# Altium project TGIS System Status.PrjPcb (part 1 of 2)
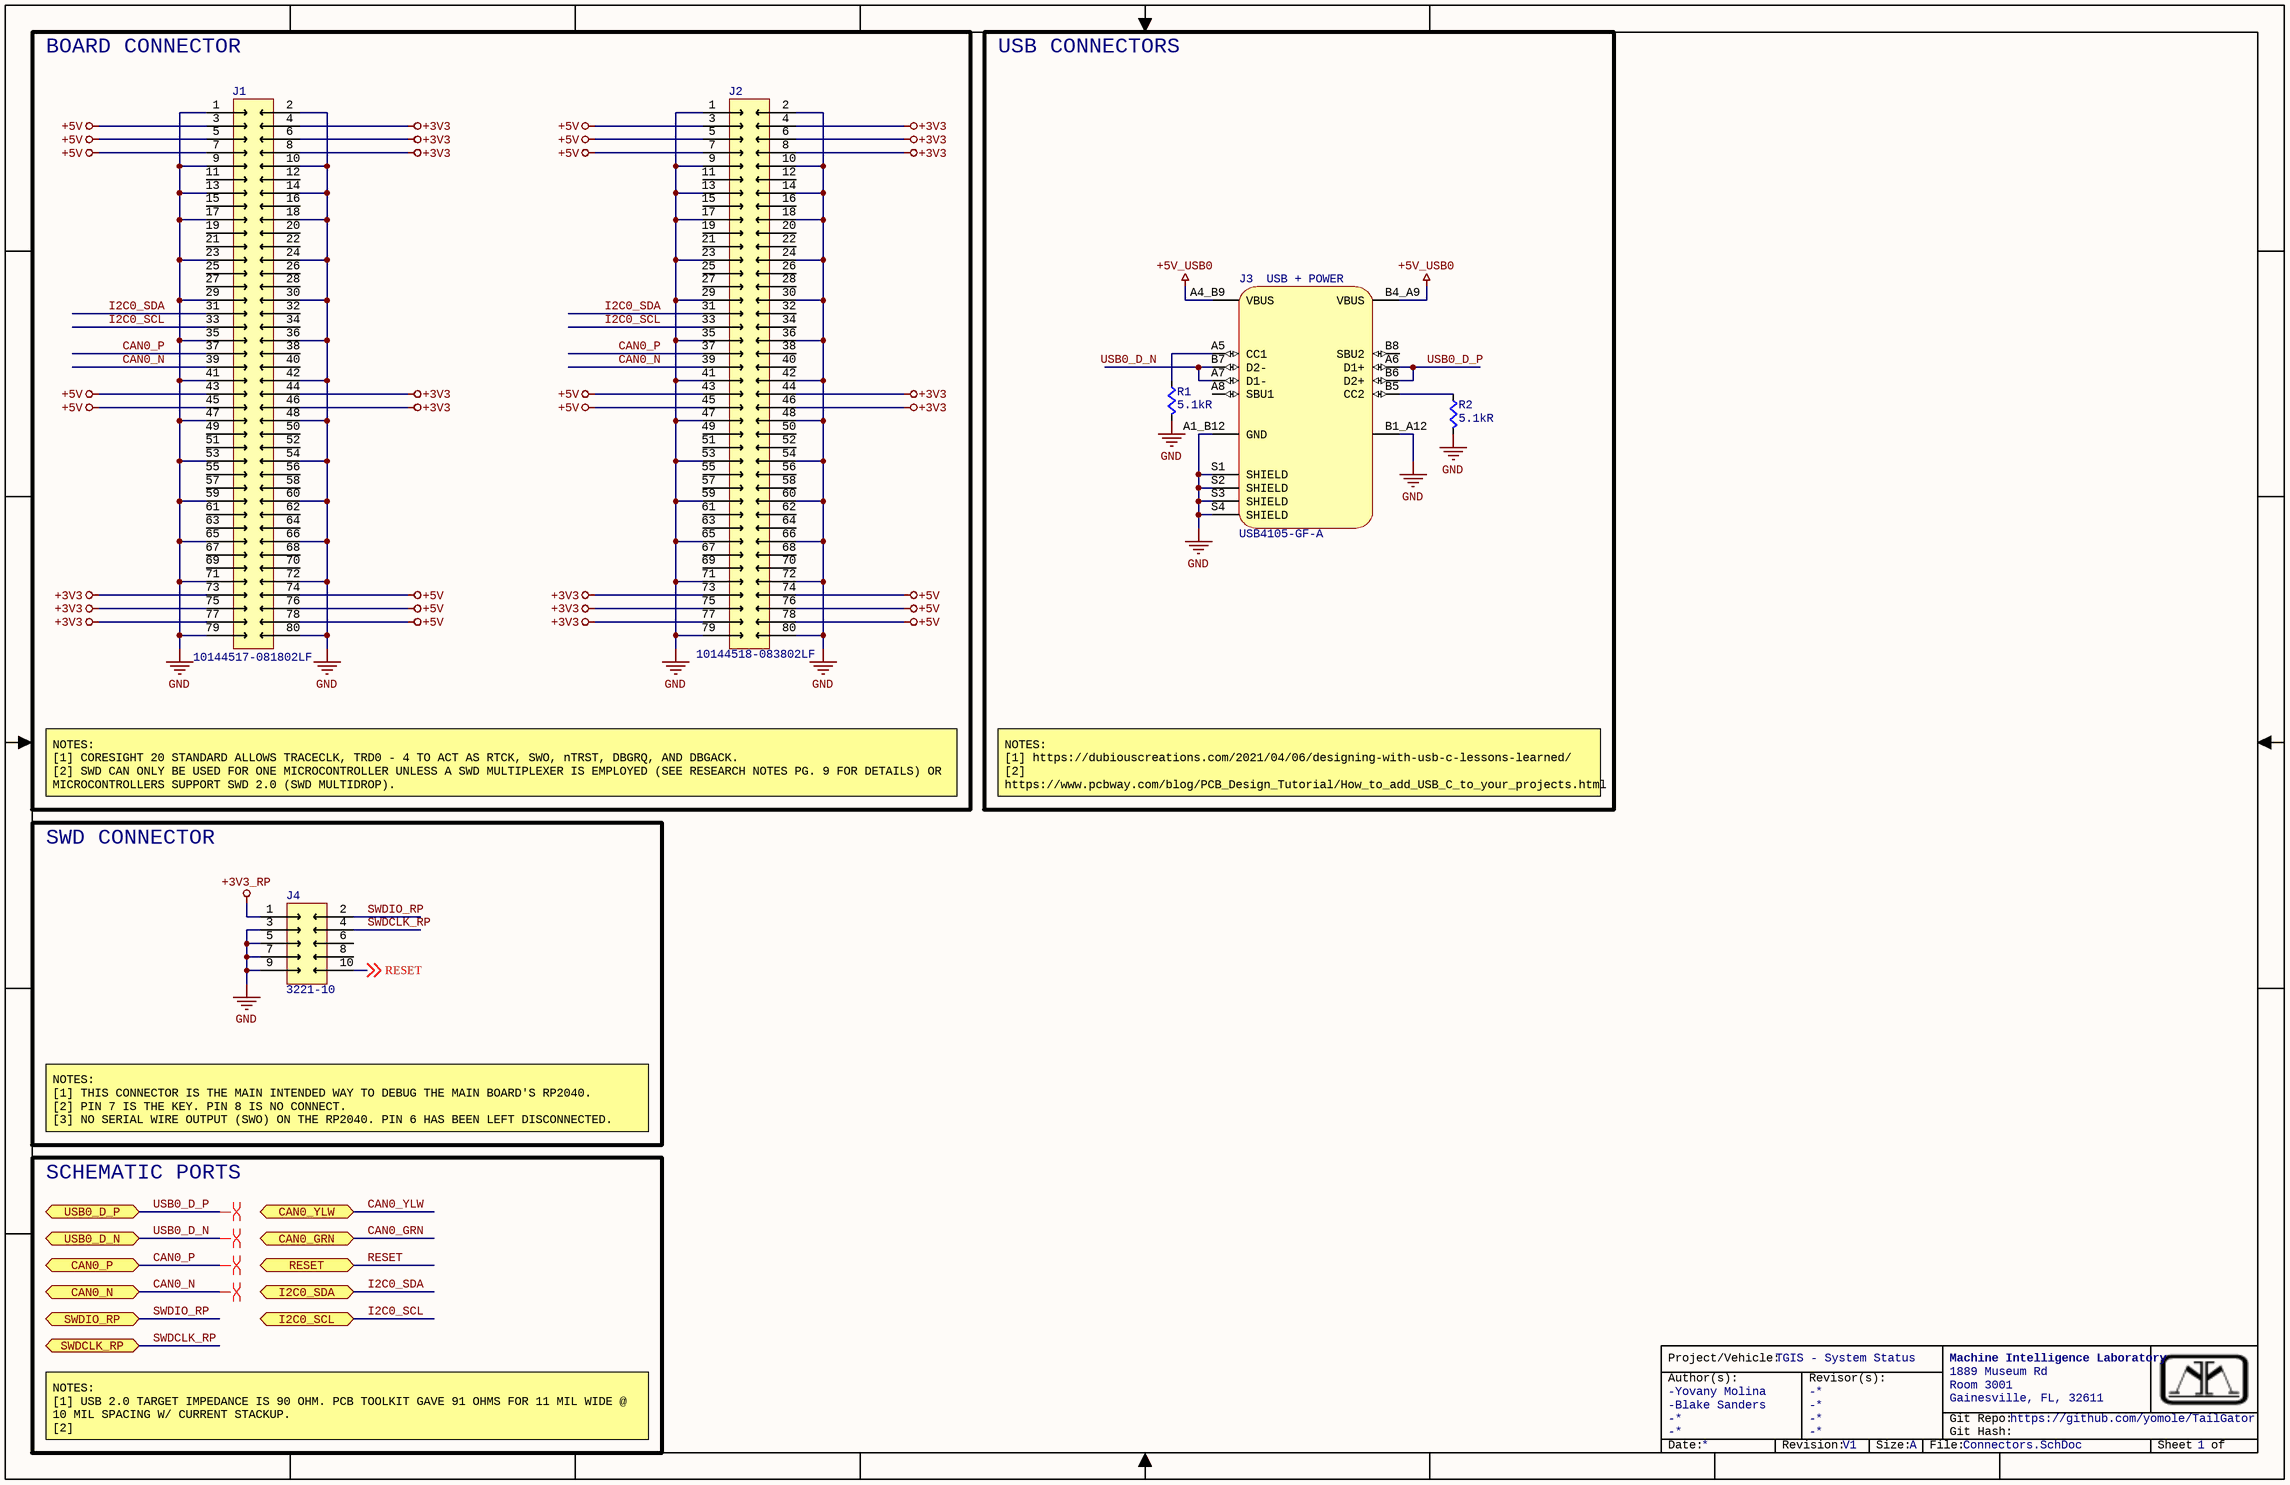
[diagram p0: Connectors.SchDoc]
Author1: Yovany Molina; Author2: Blake Sanders; Project: TGIS - System Status; Revision: V1; VersionControl_Repository: https://github.com/yomole/TailGator
4 sheets, 74 parts. Net scope: flat (ports and power ports of the same name join across sheets).
Board file: SystemStatus.PcbDoc
Sheets:
  Connectors.SchDoc
  Microcontroller.SchDoc
  Power.SchDoc
  Components.SchDoc

## Sheet Connectors.SchDoc
size 431 x 279 mm; Organization: Machine Intelligence Laboratory; Address1: 1889 Museum Rd; Address2: Room 3001; Address3: Gainesville, FL, 32611; SheetNumber: 1; SheetTotal: 4

### Parts
J1  10144517-081802LF  [AMPHENOL_10144517-081802LF]
J2  10144518-083802LF  [AMPHENOL_10144518-083802LF]
J3  USB4105-GF-A  [GCT_USB4105-GF-A]
J4  3221-10  [3220-10-0200-00]
R1  5.1kR  [RES0603]
R2  5.1kR  [RES0603]

### Blocks framed on the sheet
BOARD CONNECTOR: J1 J2
USB CONNECTORS: J3 R1 R2
SWD CONNECTOR: J4

### Ports
CAN0_GRN (bidir, see Components[3C], Microcontroller[2D]), CAN0_N (bidir, see Components[3C]), CAN0_P (bidir, see Components[3C]), CAN0_YLW (bidir, see Components[3C], Microcontroller[2C]), I2C0_SCL (bidir, see Microcontroller[2D]), I2C0_SDA (bidir, see Microcontroller[2D]), RESET (bidir), SWDCLK_RP (bidir, see Microcontroller[3C]), SWDIO_RP (bidir, see Microcontroller[3C]), USB0_D_N (bidir, see Microcontroller[2C]), USB0_D_P (bidir, see Microcontroller[2C])

### Nets
+3V3: J1.4 J1.6 J1.8 J1.44 J1.46 J1.73 J1.75 J1.77 J2.4 J2.6 J2.8 J2.44 J2.46 J2.73 J2.75 J2.77
+3V3_RP: J4.1
+5V: J1.3 J1.5 J1.7 J1.43 J1.45 J1.74 J1.76 J1.78 J2.3 J2.5 J2.7 J2.43 J2.45 J2.74 J2.76 J2.78
+5V_USB0: J3.A4_B9(VBUS) J3.B4_A9(VBUS)
GND: J1.1 J1.2 J1.9 J1.10 J1.13 J1.14 J1.17 J1.18 J1.23 J1.24 J1.29 J1.30 J1.35 J1.36 J1.41 J1.42 J1.47 J1.48 J1.53 J1.54 J1.59 J1.60 J1.65 J1.66 J1.71 J1.72 J1.79 J1.80 J2.1 J2.2 J2.9 J2.10 J2.13 J2.14 J2.17 J2.18 J2.23 J2.24 J2.29 J2.30 J2.35 J2.36 J2.41 J2.42 J2.47 J2.48 J2.53 J2.54 J2.59 J2.60 J2.65 J2.66 J2.71 J2.72 J2.79 J2.80 J3.A1_B12(GND) J3.B1_A12(\) J3.S1(SHIELD) J3.S2(SHIELD) J3.S3(SHIELD) J3.S4(SHIELD) J4.3 J4.5 J4.7 J4.9 R1.1(A) R2.1(A)
CAN0_N: J1.39 J2.39 ; port CAN0_N
CAN0_P: J1.37 J2.37 ; port CAN0_P
I2C0_SCL: J1.33 J2.33 ; port I2C0_SCL
I2C0_SDA: J1.31 J2.31 ; port I2C0_SDA
RESET: J4.10 ; off-sheet RESET, port RESET
SWDCLK_RP: J4.4 ; port SWDCLK_RP
SWDIO_RP: J4.2 ; port SWDIO_RP
USB0_D_N: J3.A7(D1-) J3.B7(D2-) ; port USB0_D_N
USB0_D_P: J3.A6(D1+) J3.B6(D2+) ; port USB0_D_P
NetJ3_A5: J3.A5(CC1) R1.2(B)
NetJ3_B5: J3.B5(CC2) R2.2(B)

Not connected (* = marked no-connect by the designer): J1 11 12 15 16 19 20 21 22 25 26 27 28 32 34 38 40 49 50 51 52 55 56 57 58 61 62 63 64 67 68 69 70; J2 11 12 15 16 19 20 21 22 25 26 27 28 32 34 38 40 49 50 51 52 55 56 57 58 61 62 63 64 67 68 69 70; J3 A8(SBU1) B8(SBU2); J4 6 8

### Layout directives
differential pair; net class USB0_D; differential pair class USB0_LINES; rule Matched Net Lengths [Tolerance = 10mil]; rule Differential Pairs Routing [Pref Gap = 4mil    Min Gap  = 4mil    Max Gap  = 4milPref Width = 6mil    Min Width  = 6mil    Max Width  = 6mil]: USB0_D_N, USB0_D_P
differential pair; rule Matched Net Lengths [Tolerance = 5mil]; rule Differential Pairs Routing [Pref Gap = 6mil    Min Gap  = 6mil    Max Gap  = 6milPref Width = 4mil    Min Width  = 4mil    Max Width  = 4mil]; net class CAN0; differential pair class CAN0_LINES: CAN0_N, CAN0_P

### Notes on the sheet
- (near J3) USB + POWER
- NOTES:
  [1] CORESIGHT 20 STANDARD ALLOWS TRACECLK, TRD0 - 4 TO ACT AS RTCK, SWO, nTRST, DBGRQ, AND DBGACK.
  [2] SWD CAN ONLY BE USED FOR ONE MICROCONTROLLER UNLESS A SWD MULTIPLEXER IS EMPLOYED (SEE RESEARCH NOTES PG. 9 FOR DETAILS) OR MICROCONTROLLERS SUPPORT SWD 2.0 (SWD MULTIDROP).
- NOTES:
  [1] https://dubiouscreations.com/2021/04/06/designing-with-usb-c-lessons-learned/
  [2] https://www.pcbway.com/blog/PCB_Design_Tutorial/How_to_add_USB_C_to_your_projects.html
  [3] DO NOT FORGET TO SECURE THE MECHANICAL POLES BEFORE CONNECTING ANYTHING.
- NOTES:
  [1] THIS CONNECTOR IS THE MAIN INTENDED WAY TO DEBUG THE MAIN BOARD'S RP2040.
  [2] PIN 7 IS THE KEY. PIN 8 IS NO CONNECT.
  [3] NO SERIAL WIRE OUTPUT (SWO) ON THE RP2040. PIN 6 HAS BEEN LEFT DISCONNECTED.
- SCHEMATIC PORTS
- NOTES:
  [1] USB 2.0 TARGET IMPEDANCE IS 90 OHM. PCB TOOLKIT GAVE 91 OHMS FOR 11 MIL WIDE @ 10 MIL SPACING W/ CURRENT STACKUP.
  [2] http://lamsimenterprises.com/COUPLED%20TRANSMISSION%20LINES%20AND%20Crosstalk.pdf
- Project/Vehicle:
- Author(s):
- -
- Revisor(s):
- Git Repo:
- Git Hash:
- Date:
- Revision:
- Size:
- A
- File:
- Sheet
- of

### Library data of the parts
J1 = 10144517-081802LF: CONN RCPT 1 80POS SMD GOLD; System: Connector; Supplier 1: Digikey; Supplier Part Number 1: 609-5437-1-ND
J2 = 10144518-083802LF: CONN PLUG 3 80POS SMD GOLD; System: Connector; Supplier 1: Digikey; Supplier Part Number 1: 609-5455-1-ND
J3 = USB4105-GF-A: USB-C (USB TYPE-C) USB 2.0 Receptacle Connector 24 (16+8 Dummy) Position Surface Mount, Right Angle; Through Hole; MP: USB4120-03-C_REVA; Package: None; Value: *; Availability: Unavailable; Price: None; Supplier 1: Newark; Supplier Part Number 1: 71AJ9393
J4 = 3221-10-0300-00: Connector Header Surface Mount 10 position 0.050" (1.27mm); Supplier 1: Digikey; Supplier Part Number 1: 1175-1735-ND
R1 R2 = RC0603FR-075K1L: Fixed Resistor, Metal Glaze/thick F; Manufacturer: Yageo; Power: 100mW; Rated Temperature: 70°C; Tolerance: 1%; Additional Feature: LASER TRIMMABLE; Temperature Coefficient: 100ppm/°C; Working Voltage: 75V; Package Height: 0.45mm; Package Length: 1.6mm; Package Width: 0.8mm; Part Number: RC0603FR-075K1L; Category: Chip SMD Resistors; Stock 1: 2654160; Pricing 1: 1=0.1, 10=0.019, 50=0.0112, 100=0.0; Mounting Technology: Surface Mount; Pins: 2; Package Shape: Rectangular; Case/Package: 0603; Terminal Finish: Nickel; Min Operating Temperature: -55°C; Max Operating Temperature: 155°C; JESD-609 Code: e3; Resistor Type: FIXED RESISTOR; Packaging: Tape and Reel; Value: 5.1kR; Termination: Wraparound; Technology: METAL GLAZE/THICK FILM; Reach SVHC Compliant: Yes; RoHS Compliant: Yes; ComponentLink1URL: https://datasheet.ciiva.com:443/pdf; ComponentLink1Description: https://datasheet.ciiva.com:443/pdf; ComponentLink2URL: https://datasheet.ciiva.com/46395/4; ComponentLink2Description: https://datasheet.ciiva.com/46395/4; ComponentLink3URL: https://datasheet.ciiva.com/2454/py; ComponentLink3Description: https://datasheet.ciiva.com/2454/py; ComponentLink4URL: https://datasheet.ciiva.com/2454/py; ComponentLink4Description: https://datasheet.ciiva.com/2454/py; ComponentLink5URL: https://datasheet.ciiva.com/2454/py; ComponentLink5Description: https://datasheet.ciiva.com/2454/py; ComponentLink6URL: https://datasheet.ciiva.com/15189/g; ComponentLink6Description: https://datasheet.ciiva.com/15189/g; Supplier Part Number 1: 311-5.10KHRCT-ND; Manufacturer Part Number: RC0603FR-075K1L; RoHS: Yes; Construction: Chip; Package Style: SMTMeter; Supplier 1: Digikey

## Sheet Microcontroller.SchDoc
size A; Organization: Machine Intelligence Laboratory; Address1: 1889 Museum Rd; Address2: Room 3001; Address3: Gainesville, FL, 32611; SheetNumber: 2; SheetTotal: 4
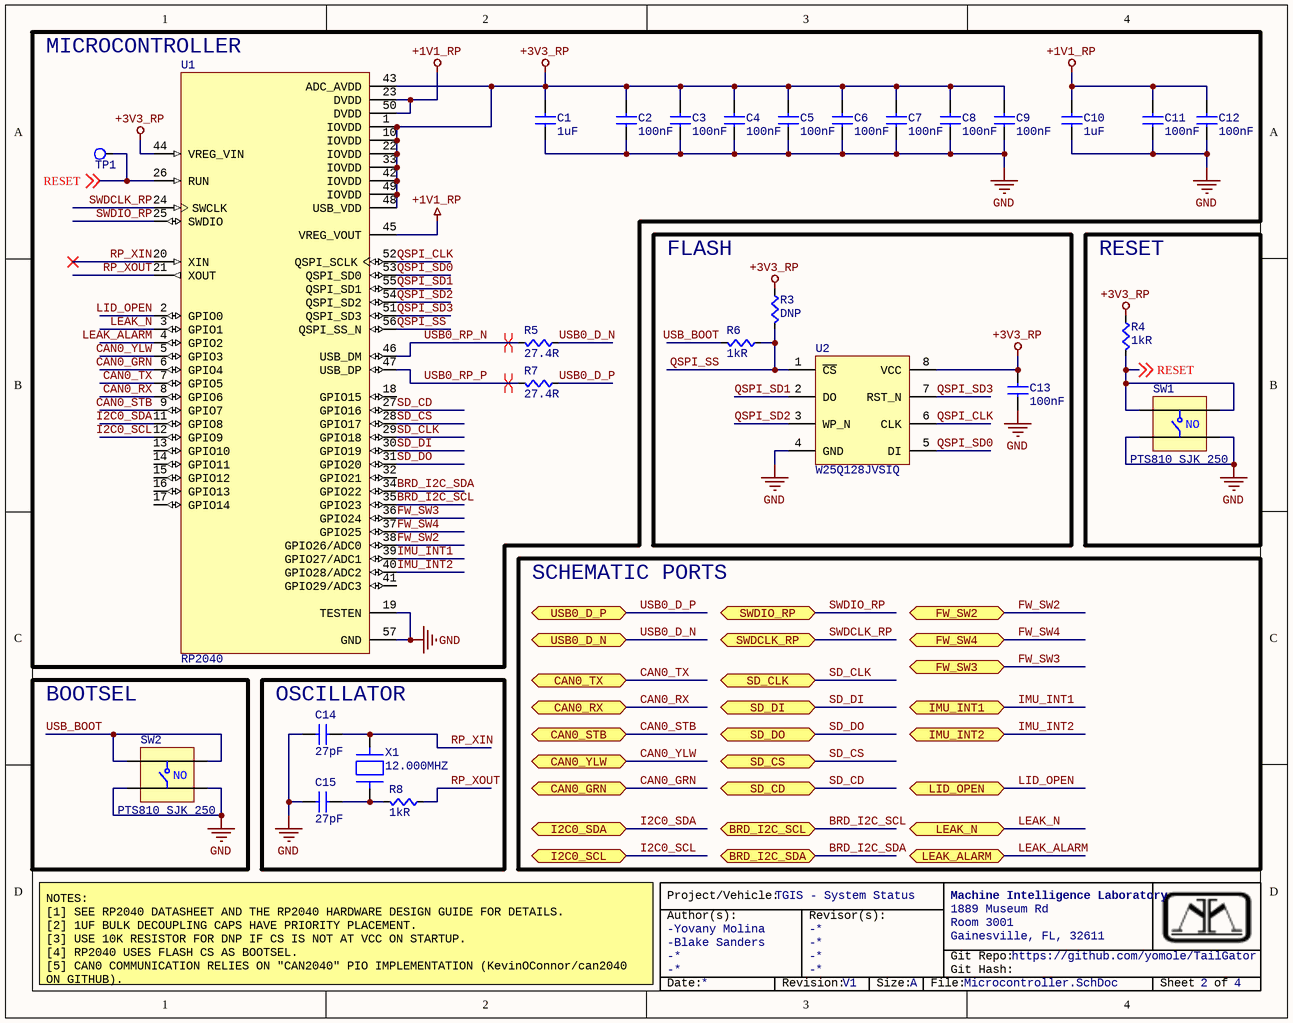
[diagram p1: Microcontroller.SchDoc]

### Parts
C1  1uF  [CAPC0603]
C2  100nF  [CAPC0603]
C3  100nF  [CAPC0603]
C4  100nF  [CAPC0603]
C5  100nF  [CAPC0603]
C6  100nF  [CAPC0603]
C7  100nF  [CAPC0603]
C8  100nF  [CAPC0603]
C9  100nF  [CAPC0603]
C10  1uF  [CAPC0603]
C11  100nF  [CAPC0603]
C12  100nF  [CAPC0603]
C13  100nF  [CAPC0603]
C14  27pF  [CAPC0603]
C15  27pF  [CAPC0603]
R3  value DNP  [RES0603]  (hidden comment: Res)
R4  1kR  [RES0603]
R5  27.4R  [RES0603]
R6  1kR  [RES0603]
R7  27.4R  [RES0603]
R8  1kR  [RES0603]
SW1  PTS810 SJK 250  [SW_PTS810_SJM_250_SMTR_LFS]
SW2  PTS810 SJK 250  [SW_PTS810_SJM_250_SMTR_LFS]
TP1  TP  [TPAD-60MIL]  (value not drawn)  (no BOM)
U1  RP2040  [QFN40P700X700X90-57N]
U2  W25Q128JVSIQ  [SOIC127P790X216-8N]
X1  12.000MHZ  [ABLS-12.000MHZ]

### Blocks framed on the sheet
MICROCONTROLLER: C1-C12 R5 R7 TP1 U1
FLASH: C13 R3 R6 U2
RESET: R4 SW1
BOOTSEL: SW2
OSCILLATOR: C14 C15 R8 X1

### Ports
BRD_I2C_SCL (bidir, see Components[3D]), BRD_I2C_SDA (bidir, see Components[3D]), CAN0_GRN (bidir, see Components[3C], Connectors[8A]), CAN0_RX (bidir, see Components[3C]), CAN0_STB (bidir, see Components[3C]), CAN0_TX (bidir, see Components[3C]), CAN0_YLW (bidir, see Components[3C], Connectors[8B]), FW_SW2 (bidir, see Components[3C]), FW_SW3 (bidir, see Components[3D]), FW_SW4 (bidir, see Components[3D]), I2C0_SCL (bidir, see Connectors[8A]), I2C0_SDA (bidir, see Connectors[8A]), IMU_INT1 (bidir, see Components[3C]), IMU_INT2 (bidir, see Components[3D]), LEAK_ALARM (bidir, see Components[3D]), LEAK_N (bidir, see Components[3D]), LID_OPEN (bidir, see Components[3C]), SD_CD (bidir, see Components[3C]), SD_CLK (bidir, see Components[3C]), SD_CS (bidir, see Components[3C]), SD_DI (bidir, see Components[3C]), SD_DO (bidir, see Components[3C]), SWDCLK_RP (bidir, see Connectors[8A]), SWDIO_RP (bidir, see Connectors[8A]), USB0_D_N (bidir, see Connectors[8A]), USB0_D_P (bidir, see Connectors[8B])

### Nets
+1V1_RP: C10.2(B) C11.2(B) C12.2(B) U1.23(DVDD) U1.45(VREG_VOUT) U1.50(DVDD)
+3V3_RP: C1.2(B) C2.2(B) C3.2(B) C4.2(B) C5.2(B) C6.2(B) C7.2(B) C8.2(B) C9.2(B) C13.2(B) R3.2(B) R4.2(B) U1.1(IOVDD) U1.10(IOVDD) U1.22(IOVDD) U1.33(IOVDD) U1.42(IOVDD) U1.43(ADC_AVDD) U1.44(VREG_VIN) U1.48(USB_VDD) U1.49(IOVDD) U2.8(VCC)
GND: C1.1(A) C2.1(A) C3.1(A) C4.1(A) C5.1(A) C6.1(A) C7.1(A) C8.1(A) C9.1(A) C10.1(A) C11.1(A) C12.1(A) C13.1(A) C14.1(A) C15.1(A) SW1.3 SW1.4 SW2.3 SW2.4 U1.19(TESTEN) U1.57(GND) U2.4(GND)
BRD_I2C_SCL: U1.35(GPIO23) ; port BRD_I2C_SCL
BRD_I2C_SDA: U1.34(GPIO22) ; port BRD_I2C_SDA
CAN0_GRN: U1.6(GPIO4) ; port CAN0_GRN
CAN0_RX: U1.8(GPIO6) ; port CAN0_RX
CAN0_STB: U1.9(GPIO7) ; port CAN0_STB
CAN0_TX: U1.7(GPIO5) ; port CAN0_TX
CAN0_YLW: U1.5(GPIO3) ; port CAN0_YLW
FW_SW2: U1.38(GPIO26/ADC0) ; port FW_SW2
FW_SW3: U1.36(GPIO24) ; port FW_SW3
FW_SW4: U1.37(GPIO25) ; port FW_SW4
I2C0_SCL: U1.12(GPIO9) ; port I2C0_SCL
I2C0_SDA: U1.11(GPIO8) ; port I2C0_SDA
IMU_INT1: U1.39(GPIO27/ADC1) ; port IMU_INT1
IMU_INT2: U1.40(GPIO28/ADC2) ; port IMU_INT2
LEAK_ALARM: U1.4(GPIO2) ; port LEAK_ALARM
LEAK_N: U1.3(GPIO1) ; port LEAK_N
LID_OPEN: U1.2(GPIO0) ; port LID_OPEN
QSPI_CLK: U1.52(QSPI_SCLK) U2.6(CLK)
QSPI_SD0: U1.53(QSPI_SD0) U2.5(DI)
QSPI_SD1: U1.55(QSPI_SD1) U2.2(DO)
QSPI_SD2: U1.54(QSPI_SD2) U2.3(WP_N)
QSPI_SD3: U1.51(QSPI_SD3) U2.7(RST_N)
QSPI_SS: R3.1(A) R6.2(B) U1.56(QSPI_SS_N) U2.1(~{CS})
RESET: R4.1(A) SW1.1 SW1.2 TP1.1 U1.26(RUN) ; off-sheet RESET
RP_XIN: C14.2(B) U1.20(XIN) X1.2
RP_XOUT: R8.2(B) U1.21(XOUT)
SD_CD: U1.27(GPIO16) ; port SD_CD
SD_CLK: U1.29(GPIO18) ; port SD_CLK
SD_CS: U1.28(GPIO17) ; port SD_CS
SD_DI: U1.30(GPIO19) ; port SD_DI
SD_DO: U1.31(GPIO20) ; port SD_DO
SWDCLK_RP: U1.24(SWCLK) ; port SWDCLK_RP
SWDIO_RP: U1.25(SWDIO) ; port SWDIO_RP
USB0_D_N: R5.2(B) ; port USB0_D_N
USB0_D_P: R7.2(B) ; port USB0_D_P
USB0_RP_N: R5.1(A) U1.46(USB_DM)
USB0_RP_P: R7.1(A) U1.47(USB_DP)
USB_BOOT: R6.1(A) SW2.1 SW2.2
NetC15_2: C15.2(B) R8.1(A) X1.1

Not connected (* = marked no-connect by the designer): U1 13(GPIO10) 14(GPIO11) 15(GPIO12) 16(GPIO13) 17(GPIO14) 18(GPIO15) 32(GPIO21) 41(GPIO29/ADC3)

### Layout directives
differential pair; net class USB0_RP; differential pair class USB0_RP_LINES; rule Matched Net Lengths [Tolerance = 10mil]; rule Differential Pairs Routing [Pref Gap = 4mil    Min Gap  = 4mil    Max Gap  = 5milPref Width = 6mil    Min Width  = 5mil    Max Width  = 6mil]: USB0_RP_N, USB0_RP_P

### Notes on the sheet
- SCHEMATIC PORTS
- NOTES:
  [1] SEE RP2040 DATASHEET AND THE RP2040 HARDWARE DESIGN GUIDE FOR DETAILS.
  [2] 1UF BULK DECOUPLING CAPS HAVE PRIORITY PLACEMENT.
  [3] USE 10K RESISTOR FOR DNP IF CS IS NOT AT VCC ON STARTUP.
  [4] RP2040 USES FLASH CS AS BOOTSEL.
  [5] CAN0 COMMUNICATION RELIES ON "CAN2040" PIO IMPLEMENTATION (KevinOConnor/can2040 ON GITHUB).
- Project/Vehicle:
- Author(s):
- -
- Revisor(s):
- Git Repo:
- Git Hash:
- Date:
- Revision:
- Size:
- A
- File:
- Sheet
- of
- (in symbol PTS810 SJK 250 SMTR LFS) NO

### Library data of the parts
C1 C10 = CC0603KRX7R7BB105: Ceramic Capacitor, Multilayer, Cera; Manufacturer: Yageo; Multilayer: Yes; Tolerance  (fill in as +-): 10%; Rated DC Voltage (URdc): 16V; Temperature Characteristics Code: X7R; Part Number: CC0603KRX7R7BB105; Category: Ceramic Capacitors; Stock 1: 9695416; Pricing 1: 1=0.1, 10=0.066, 50=0.0392, 100=0.0; Mounting Technology: Surface Mount; Pins: 2; Package Shape: Rectangular; Case/Package: 0603; Terminal Finish: Nickel; Min Operating Temperature: -55°C; Max Operating Temperature: 125°C; JESD-609 Code: e3; Packaging: Tape and Reel; Value: 1uF; Termination: Wraparound; Reach SVHC Compliant: Yes; RoHS Compliant: Yes; ComponentLink1URL: https://datasheet.ciiva.com:443/pdf; ComponentLink1Description: https://datasheet.ciiva.com:443/pdf; ComponentLink2URL: https://datasheet.ciiva.com/8033/17; ComponentLink2Description: https://datasheet.ciiva.com/8033/17; ComponentLink3URL: https://datasheet.ciiva.com/8033/17; ComponentLink3Description: https://datasheet.ciiva.com/8033/17; ComponentLink4URL: https://datasheet.ciiva.com/7978/14; ComponentLink4Description: https://datasheet.ciiva.com/7978/14; ComponentLink5URL: https://datasheet.ciiva.com/28450/1; ComponentLink5Description: https://datasheet.ciiva.com/28450/1; ComponentLink6URL: https://datasheet.ciiva.com/176/mlc; ComponentLink6Description: https://datasheet.ciiva.com/176/mlc; ComponentLink7URL: https://datasheet.ciiva.com/176/mlc; ComponentLink7Description: https://datasheet.ciiva.com/176/mlc; ComponentLink8URL: https://datasheet.ciiva.com/176/mlc; ComponentLink8Description: https://datasheet.ciiva.com/176/mlc; ComponentLink9URL: https://datasheet.ciiva.com/5425/up; ComponentLink9Description: https://datasheet.ciiva.com/5425/up; Supplier Part Number 1: 311-1446-1-ND; Manufacturer Part Number: CC0603KRX7R7BB105; RoHS: Yes; Package Style: SMTMeter; Supplier 1: Digikey; Dielectric Material: Ceramic; Capacitor Type: Ceramic; Tolerance (fill in as +-): 10%; Length: 1.6mm; Width: 0.8mm; Height: 0.8mm
C2-C9 C11-C13 = CC0603KRX7R7BB104: Ceramic Capacitor, Multilayer, Cera; Manufacturer: Yageo; Multilayer: Yes; Tolerance  (fill in as +-): 10%; Rated DC Voltage (URdc): 16V; Temperature Characteristics Code: X7R; Part Number: CC0603KRX7R7BB104; Category: Ceramic Capacitors; Stock 1: 11347706; Pricing 1: 1=0.1, 10=0.042, 50=0.0238, 100=0.0; Mounting Technology: Surface Mount; Pins: 2; Package Shape: Rectangular; Case/Package: 0603; Terminal Finish: Nickel; Min Operating Temperature: -55°C; Max Operating Temperature: 125°C; JESD-609 Code: e3; Packaging: Tape and Reel; Value: 100nF; Termination: Wraparound; Reach SVHC Compliant: Yes; RoHS Compliant: Yes; ComponentLink1URL: https://datasheet.ciiva.com:443/pdf; ComponentLink1Description: https://datasheet.ciiva.com:443/pdf; ComponentLink2URL: https://datasheet.ciiva.com/11786/0; ComponentLink2Description: https://datasheet.ciiva.com/11786/0; ComponentLink3URL: https://datasheet.ciiva.com/8033/70; ComponentLink3Description: https://datasheet.ciiva.com/8033/70; ComponentLink4URL: https://datasheet.ciiva.com/7978/14; ComponentLink4Description: https://datasheet.ciiva.com/7978/14; ComponentLink5URL: https://datasheet.ciiva.com/28450/1; ComponentLink5Description: https://datasheet.ciiva.com/28450/1; ComponentLink6URL: https://datasheet.ciiva.com/46430/1; ComponentLink6Description: https://datasheet.ciiva.com/46430/1; ComponentLink7URL: https://datasheet.ciiva.com/144/mlc; ComponentLink7Description: https://datasheet.ciiva.com/144/mlc; ComponentLink8URL: https://datasheet.ciiva.com/144/mlc; ComponentLink8Description: https://datasheet.ciiva.com/144/mlc; ComponentLink9URL: https://datasheet.ciiva.com/144/mlc; ComponentLink9Description: https://datasheet.ciiva.com/144/mlc; Supplier Part Number 1: 311-1088-1-ND; Manufacturer Part Number: CC0603KRX7R7BB104; RoHS: Yes; Package Style: SMTMeter; Supplier 1: Digikey; Dielectric Material: Ceramic; Capacitor Type: Ceramic; Tolerance (fill in as +-): 10%; Length: 1.6mm; Width: 0.8mm; Height: 0.8mm; ComponentLink10URL: https://datasheet.ciiva.com/8033/17; ComponentLink10Description: https://datasheet.ciiva.com/8033/17; ComponentLink11URL: https://datasheet.ciiva.com/13395/u; ComponentLink11Description: https://datasheet.ciiva.com/13395/u; ComponentLink12URL: https://datasheet.ciiva.com/11464/u; ComponentLink12Description: https://datasheet.ciiva.com/11464/u; ComponentLink13URL: https://datasheet.ciiva.com/15165/g; ComponentLink13Description: https://datasheet.ciiva.com/15165/g; ComponentLink14URL: https://datasheet.ciiva.com:443/pdfs/VipMasterIC/IC/YAGO/YAGO-S-A0003557223; ComponentLink14Description: https://datasheet.ciiva.com:443/pdfs/VipMasterIC/IC/YAGO/YAGO-S-A0003557223; ComponentLink15URL: https://datasheet.ciiva.com/11786/0900766b80d84f1d-11786077.pdf?src-supplie; ComponentLink15Description: https://datasheet.ciiva.com/11786/0900766b80d84f1d-11786077.pdf?src-supplie; ComponentLink16URL: https://datasheet.ciiva.com/8033/70765-8033799.pdf?src-supplier=Element14; ComponentLink16Description: https://datasheet.ciiva.com/8033/70765-8033799.pdf?src-supplier=Element14; ComponentLink17URL: https://datasheet.ciiva.com/7978/1489800-7978141.pdf?src-supplier=Element14; ComponentLink17Description: https://datasheet.ciiva.com/7978/1489800-7978141.pdf?src-supplier=Element14; ComponentLink18URL: https://datasheet.ciiva.com/28450/1489800-28450552.pdf?src-supplier=Element
C14 C15 = CC0603JRNPO9BN270: Ceramic Capacitor, Multilayer, Cera; Manufacturer: Yageo; Multilayer: Yes; Tolerance  (fill in as +-): 5%; Rated DC Voltage (URdc): 50V; Temperature Characteristics Code: C0G; Part Number: CC0603JRNPO9BN270; Category: Ceramic Capacitors; Stock 1: 110865; Pricing 1: 1=0.1, 10=0.033, 50=0.0188, 100=0.0; Mounting Technology: Surface Mount; Pins: 2; Package Shape: Rectangular; Case/Package: 0603; Terminal Finish: Nickel; Min Operating Temperature: -55°C; Max Operating Temperature: 125°C; JESD-609 Code: e3; Packaging: Tape and Reel; Value: 27pF; Termination: Wraparound; Reach SVHC Compliant: Yes; RoHS Compliant: Yes; ComponentLink1URL: https://datasheet.ciiva.com:443/pdf; ComponentLink1Description: https://datasheet.ciiva.com:443/pdf; ComponentLink2URL: https://datasheet.ciiva.com/26862/g; ComponentLink2Description: https://datasheet.ciiva.com/26862/g; ComponentLink3URL: https://datasheet.ciiva.com/8033/14; ComponentLink3Description: https://datasheet.ciiva.com/8033/14; ComponentLink4URL: https://datasheet.ciiva.com/46430/1; ComponentLink4Description: https://datasheet.ciiva.com/46430/1; ComponentLink5URL: https://datasheet.ciiva.com/144/mlc; ComponentLink5Description: https://datasheet.ciiva.com/144/mlc; ComponentLink6URL: https://datasheet.ciiva.com/144/mlc; ComponentLink6Description: https://datasheet.ciiva.com/144/mlc; ComponentLink7URL: https://datasheet.ciiva.com/144/mlc; ComponentLink7Description: https://datasheet.ciiva.com/144/mlc; ComponentLink8URL: https://datasheet.ciiva.com/8033/17; ComponentLink8Description: https://datasheet.ciiva.com/8033/17; ComponentLink9URL: https://datasheet.ciiva.com/8033/17; ComponentLink9Description: https://datasheet.ciiva.com/8033/17; Supplier Part Number 1: 311-1063-1-ND; Manufacturer Part Number: CC0603JRNPO9BN270; RoHS: Yes; Package Style: SMTMeter; Supplier 1: Digikey; Dielectric Material: Ceramic; Capacitor Type: Ceramic; Tolerance (fill in as +-): 5%; Length: 1.6mm; Width: 0.8mm; Height: 0.8mm; ComponentLink10URL: https://datasheet.ciiva.com/11464/u; ComponentLink10Description: https://datasheet.ciiva.com/11464/u
R4 R6 R8 = RC0603FR-071KL: Fixed Resistor, Metal Glaze/thick F; Manufacturer: Yageo; Power: 100mW; Rated Temperature: 70°C; Tolerance: 1%; Additional Feature: LASER TRIMMABLE; Temperature Coefficient: 100ppm/°C; Working Voltage: 75V; Package Height: 0.45mm; Package Length: 1.6mm; Package Width: 0.8mm; Part Number: RC0603FR-071KL; Category: Chip SMD Resistors; Stock 1: 11540000; Pricing 1: 5000=0.0015, 50000=0.0014, 150000=0; Mounting Technology: Surface Mount; Pins: 2; Package Shape: Rectangular; Case/Package: 0603; Terminal Finish: Nickel; Min Operating Temperature: -55°C; Max Operating Temperature: 155°C; JESD-609 Code: e3; Resistor Type: FIXED RESISTOR; Packaging: Tape and Reel; Value: 1kR; Termination: Wraparound; Technology: METAL GLAZE/THICK FILM; Reach SVHC Compliant: Yes; RoHS Compliant: Yes; ComponentLink1URL: https://datasheet.ciiva.com:443/pdf; ComponentLink1Description: https://datasheet.ciiva.com:443/pdf; ComponentLink2URL: https://datasheet.ciiva.com/11808/0; ComponentLink2Description: https://datasheet.ciiva.com/11808/0; ComponentLink3URL: https://datasheet.ciiva.com/7746/16; ComponentLink3Description: https://datasheet.ciiva.com/7746/16; ComponentLink4URL: https://datasheet.ciiva.com/7660/18; ComponentLink4Description: https://datasheet.ciiva.com/7660/18; ComponentLink5URL: https://datasheet.ciiva.com/7983/44; ComponentLink5Description: https://datasheet.ciiva.com/7983/44; ComponentLink6URL: https://datasheet.ciiva.com/7746/17; ComponentLink6Description: https://datasheet.ciiva.com/7746/17; ComponentLink7URL: https://datasheet.ciiva.com/7746/17; ComponentLink7Description: https://datasheet.ciiva.com/7746/17; ComponentLink8URL: https://datasheet.ciiva.com/8896/py; ComponentLink8Description: https://datasheet.ciiva.com/8896/py; ComponentLink9URL: https://datasheet.ciiva.com/15189/g; ComponentLink9Description: https://datasheet.ciiva.com/15189/g; Supplier Part Number 1: 4016291; Manufacturer Part Number: RC0603FR-071KL; RoHS: Yes; Construction: Chip; Package Style: SMTMeter
R5 R7 = RC0603FR-0727R4L: Fixed Resistor, Metal Glaze/thick F; Manufacturer: Yageo; Power: 100mW; Rated Temperature: 70°C; Tolerance: 1%; Additional Feature: LASER TRIMMABLE; Temperature Coefficient: 100ppm/°C; Working Voltage: 75V; Package Height: 0.45mm; Package Length: 1.6mm; Package Width: 0.8mm; Part Number: RC0603FR-0727R4L; Category: Chip SMD Resistors; Stock 1: 178500; Pricing 1: 1=0.1, 10=0.02, 50=0.0124, 100=0.01; Mounting Technology: Surface Mount; Pins: 2; Package Shape: Rectangular; Case/Package: 0603; Terminal Finish: Nickel; Min Operating Temperature: -55°C; Max Operating Temperature: 155°C; JESD-609 Code: e3; Resistor Type: FIXED RESISTOR; Packaging: Tape and Reel; Value: 27.4R; Termination: Wraparound; Technology: METAL GLAZE/THICK FILM; Reach SVHC Compliant: Yes; RoHS Compliant: Yes; ComponentLink1URL: https://datasheet.ciiva.com:443/pdf; ComponentLink1Description: https://datasheet.ciiva.com:443/pdf; ComponentLink2URL: https://datasheet.ciiva.com/2454/py; ComponentLink2Description: https://datasheet.ciiva.com/2454/py; ComponentLink3URL: https://datasheet.ciiva.com/2454/py; ComponentLink3Description: https://datasheet.ciiva.com/2454/py; ComponentLink4URL: https://datasheet.ciiva.com/2454/py; ComponentLink4Description: https://datasheet.ciiva.com/2454/py; ComponentLink5URL: https://datasheet.ciiva.com/8889/py; ComponentLink5Description: https://datasheet.ciiva.com/8889/py; ComponentLink6URL: https://datasheet.ciiva.com/15160/g; ComponentLink6Description: https://datasheet.ciiva.com/15160/g; Supplier Part Number 1: 311-27.4HRCT-ND; Manufacturer Part Number: RC0603FR-0727R4L; RoHS: Yes; Construction: Chip; Package Style: SMTMeter; Supplier 1: Digikey
SW1 SW2 = PTS810 SJK 250 SMTR LFS: Tactile Switch SPST-NO Top Actuated Surface Mount; Supplier 1: Digikey; Supplier Part Number 1: CKN10503CT-ND
U1 = SC0914(13): ARM® Cortex®-M0+ - Microcontroller IC 32-Bit Dual-Core 133MHz External Program Memory 56-QFN (7x7); MF: Raspberry Pi; SnapEDA_Link: https://www.snapeda.com/parts/SC0914(13)/Raspberry+Pi/view-part/?ref=snap; Package: VFQFN-56 Raspberry Pi; Value: *; MP: SC0914(13); Check_prices: https://www.snapeda.com/parts/SC0914(13)/Raspberry+Pi/view-part/?ref=eda; Supplier 1: Digikey; Supplier Part Number 1: 2648-SC0914(13)CT-ND
U2 = W25Q128JVSIQ: FLASH - NOR Memory IC 128Mbit SPI - Quad I/O, QPI, DTR 133 MHz 8-SOIC; Supplier 1: Digikey; Supplier Part Number 1: W25Q128JVSIQCT-ND
X1 = ABLS-12.000MHZ: 12 MHz ±20ppm Crystal 18pF 50 Ohms HC-49/US; Supplier 1: Digikey; Supplier Part Number 1: 535-9067-1-ND
R3 = Res: Supplier 1: Digi-Key; Supplier Part Number 1: RMCF0603JT10K0CT-ND

## Sheet Power.SchDoc
size A; Organization: Machine Intelligence Laboratory; Address1: 1889 Museum Rd; Address2: Room 3001; Address3: Gainesville, FL, 32611; SheetNumber: 3; SheetTotal: 4
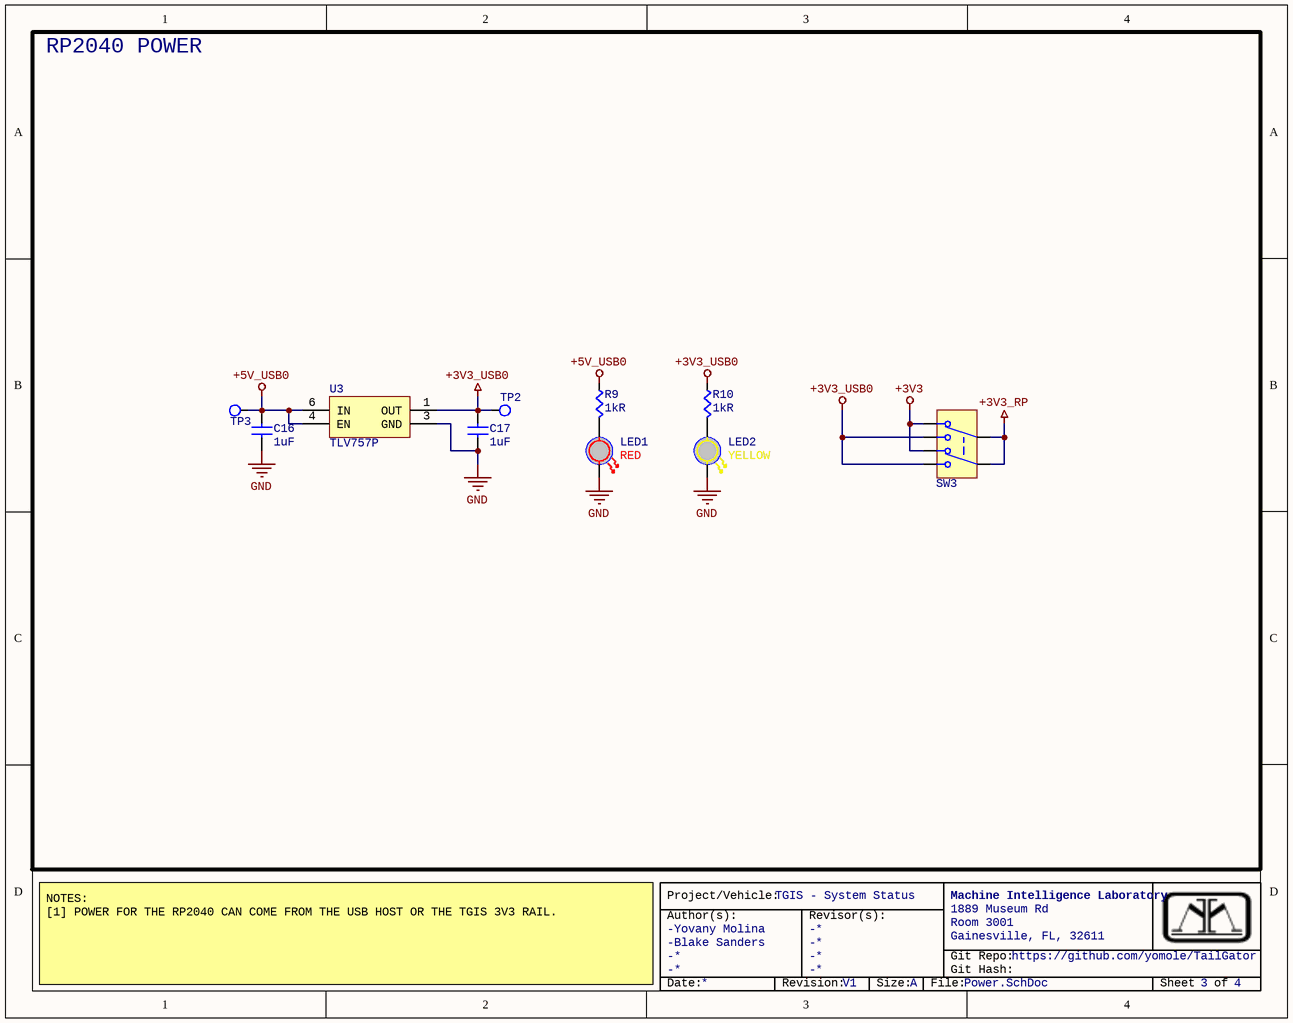
[diagram p2: Power.SchDoc]

### Parts
C16  1uF  [CAPC0603]
C17  1uF  [CAPC0603]
LED1  RED  [LED0603]
LED2  YELLOW  [LED0603]
R9  1kR  [RES0603]
R10  1kR  [RES0603]
SW3  JS202011SCQN  [SW_JS202011SCQN]  (value not drawn)
TP2  TP  [TPAD-60MIL]  (value not drawn)  (no BOM)
TP3  TP  [TPAD-60MIL]  (value not drawn)  (no BOM)
U3  TLV757P  [VREG_TLV75733PDRVR]

### Blocks framed on the sheet
RP2040 POWER: C16 C17 LED1 LED2 R9 R10 SW3 TP2 TP3 U3

### Nets
+3V3: SW3.1 SW3.4
+3V3_RP: SW3.2 SW3.5
+3V3_USB0: C17.2(B) R10.2(B) SW3.3 SW3.6 TP2.1 U3.1(OUT)
+5V_USB0: C16.2(B) R9.2(B) TP3.1 U3.4(EN) U3.6(IN)
GND: C16.1(A) C17.1(A) LED1.C LED2.C U3.3(GND)
NetLED1_A: LED1.A R9.1(A)
NetLED2_A: LED2.A R10.1(A)

### Notes on the sheet
- NOTES:
  [1] POWER FOR THE RP2040 CAN COME FROM THE USB HOST OR THE TGIS 3V3 RAIL.
- Project/Vehicle:
- Author(s):
- -
- Revisor(s):
- Git Repo:
- Git Hash:
- Date:
- Revision:
- Size:
- A
- File:
- Sheet
- of

### Library data of the parts
C16 C17 = CC0603KRX7R7BB105: as C1 on sheet Microcontroller; Part Number: CC0603KRX7R7BB105; Category: Ceramic Capacitors; Stock 1: 9695416; Pricing 1: 1=0.1, 10=0.066, 50=0.0392, 100=0.0; Mounting Technology: Surface Mount; Pins: 2; Package Shape: Rectangular; Case/Package: 0603; Terminal Finish: Nickel; Min Operating Temperature: -55°C; Max Operating Temperature: 125°C; JESD-609 Code: e3; Packaging: Tape and Reel; Value: 1uF; Termination: Wraparound; Reach SVHC Compliant: Yes; RoHS Compliant: Yes; ComponentLink1URL: https://datasheet.ciiva.com:443/pdf; ComponentLink1Description: https://datasheet.ciiva.com:443/pdf; ComponentLink2URL: https://datasheet.ciiva.com/8033/17; ComponentLink2Description: https://datasheet.ciiva.com/8033/17; ComponentLink3URL: https://datasheet.ciiva.com/8033/17; ComponentLink3Description: https://datasheet.ciiva.com/8033/17; ComponentLink4URL: https://datasheet.ciiva.com/7978/14; ComponentLink4Description: https://datasheet.ciiva.com/7978/14; ComponentLink5URL: https://datasheet.ciiva.com/28450/1; ComponentLink5Description: https://datasheet.ciiva.com/28450/1; ComponentLink6URL: https://datasheet.ciiva.com/176/mlc; ComponentLink6Description: https://datasheet.ciiva.com/176/mlc; ComponentLink7URL: https://datasheet.ciiva.com/176/mlc; ComponentLink7Description: https://datasheet.ciiva.com/176/mlc; ComponentLink8URL: https://datasheet.ciiva.com/176/mlc; ComponentLink8Description: https://datasheet.ciiva.com/176/mlc; ComponentLink9URL: https://datasheet.ciiva.com/5425/up; ComponentLink9Description: https://datasheet.ciiva.com/5425/up; Supplier Part Number 1: 311-1446-1-ND; Manufacturer Part Number: CC0603KRX7R7BB105; RoHS: Yes; Package Style: SMTMeter; Supplier 1: Digikey; Dielectric Material: Ceramic; Capacitor Type: Ceramic; Tolerance (fill in as +-): 10%; Length: 1.6mm; Width: 0.8mm; Height: 0.8mm
LED1 = 150060RS75000: Single Color LED, Red, Water Clear,; Manufacturer: Wurth Electronics; Shape: Rectangular; Forward Current: 30mA; Luminous Intensity-Nom: 250mcd; Channels: 1; Viewing Angle: 140°; Overall Height: 0.7mm; Part Number: 150060RS75000; Category: LEDs; Stock 1: 139850; Pricing 1: 1=0.15, 50=0.142, 100=0.122, 500=0.; Mounting Technology: Surface Mount; Pins: 2; Min Operating Temperature: -40°C; Max Operating Temperature: 85°C; Packaging: Tape and Reel; Reach SVHC Compliant: Yes; RoHS Compliant: Yes; ComponentLink1URL: https://datasheet.ciiva.com:443/pdf; ComponentLink1Description: https://datasheet.ciiva.com:443/pdf; ComponentLink2URL: https://datasheet.ciiva.com/29563/1; ComponentLink2Description: https://datasheet.ciiva.com/29563/1; ComponentLink3URL: https://datasheet.ciiva.com/29279/7; ComponentLink3Description: https://datasheet.ciiva.com/29279/7; Supplier Part Number 1: 732-4978-1-ND; Manufacturer Part Number: 150060RS75000; RoHS: Yes; Supplier 1: Digikey; Color: Red; Lens Style: WATER CLEAR; Optoelectronic Device Type: SINGLE COLOR LED; Size: 1.1mm; Terminal Pitch: 1.6mm
LED2 = 150060YS75000: Single Color LED, Yellow, Water Cle; Manufacturer: Wurth Electronics; Shape: Rectangular; Lens Style: WATER CLEAR; Forward Current: 30mA; Luminous Intensity-Nom: 120mcd; Channels: 1; Viewing Angle: 140°; Overall Height: 0.7mm; Part Number: 150060YS75000; Category: LEDs; Stock 1: 50357; Pricing 1: 1=0.15, 50=0.142, 100=0.122, 500=0.; Mounting Technology: Surface Mount; Pins: 2; Min Operating Temperature: -40°C; Max Operating Temperature: 85°C; Packaging: Tape and Reel; Reach SVHC Compliant: Yes; RoHS Compliant: Yes; ComponentLink1URL: https://datasheet.ciiva.com:443/pdf; ComponentLink1Description: https://datasheet.ciiva.com:443/pdf; ComponentLink2URL: https://datasheet.ciiva.com/23843/1; ComponentLink2Description: https://datasheet.ciiva.com/23843/1; ComponentLink3URL: https://datasheet.ciiva.com/29279/7; ComponentLink3Description: https://datasheet.ciiva.com/29279/7; ComponentLink4URL: https://datasheet.ciiva.com/22656/1; ComponentLink4Description: https://datasheet.ciiva.com/22656/1; ComponentLink5URL: https://datasheet.ciiva.com/29563/1; ComponentLink5Description: https://datasheet.ciiva.com/29563/1; ComponentLink6URL: https://datasheet.ciiva.com/29563/1; ComponentLink6Description: https://datasheet.ciiva.com/29563/1; ComponentLink7URL: https://datasheet.ciiva.com/48430/1; ComponentLink7Description: https://datasheet.ciiva.com/48430/1; Supplier Part Number 1: 732-4981-1-ND; Manufacturer Part Number: 150060YS75000; RoHS: Yes; Supplier 1: Digikey; Color: Yellow; Optoelectronic Device Type: SINGLE COLOR LED; Size: 1.1mm; Terminal Pitch: 1.6mm
R9 R10 = RC0603FR-071KL: as R4 on sheet Microcontroller; Part Number: RC0603FR-071KL; Category: Chip SMD Resistors; Stock 1: 11540000; Pricing 1: 5000=0.0015, 50000=0.0014, 150000=0; Mounting Technology: Surface Mount; Pins: 2; Package Shape: Rectangular; Case/Package: 0603; Terminal Finish: Nickel; Min Operating Temperature: -55°C; Max Operating Temperature: 155°C; JESD-609 Code: e3; Resistor Type: FIXED RESISTOR; Packaging: Tape and Reel; Value: 1kR; Termination: Wraparound; Technology: METAL GLAZE/THICK FILM; Reach SVHC Compliant: Yes; RoHS Compliant: Yes; ComponentLink1URL: https://datasheet.ciiva.com:443/pdf; ComponentLink1Description: https://datasheet.ciiva.com:443/pdf; ComponentLink2URL: https://datasheet.ciiva.com/11808/0; ComponentLink2Description: https://datasheet.ciiva.com/11808/0; ComponentLink3URL: https://datasheet.ciiva.com/7746/16; ComponentLink3Description: https://datasheet.ciiva.com/7746/16; ComponentLink4URL: https://datasheet.ciiva.com/7660/18; ComponentLink4Description: https://datasheet.ciiva.com/7660/18; ComponentLink5URL: https://datasheet.ciiva.com/7983/44; ComponentLink5Description: https://datasheet.ciiva.com/7983/44; ComponentLink6URL: https://datasheet.ciiva.com/7746/17; ComponentLink6Description: https://datasheet.ciiva.com/7746/17; ComponentLink7URL: https://datasheet.ciiva.com/7746/17; ComponentLink7Description: https://datasheet.ciiva.com/7746/17; ComponentLink8URL: https://datasheet.ciiva.com/8896/py; ComponentLink8Description: https://datasheet.ciiva.com/8896/py; ComponentLink9URL: https://datasheet.ciiva.com/15189/g; ComponentLink9Description: https://datasheet.ciiva.com/15189/g; Supplier Part Number 1: 4016291; Manufacturer Part Number: RC0603FR-071KL; RoHS: Yes; Construction: Chip; Package Style: SMTMeter
SW3 = JS202011SCQN: Slide Switch DPDT Surface Mount; Supplier 1: Digikey; Supplier Part Number 1: 401-2002-1-ND
U3 = TLV75733PDRVR: Linear Voltage Regulator IC Positive Fixed 1 Output 1A 6-WSON (2x2); Supplier 1: Digikey; Supplier Part Number 1: 296-49281-1-ND